# Altium schematic sheet betaV1.0.SchDoc
size A2
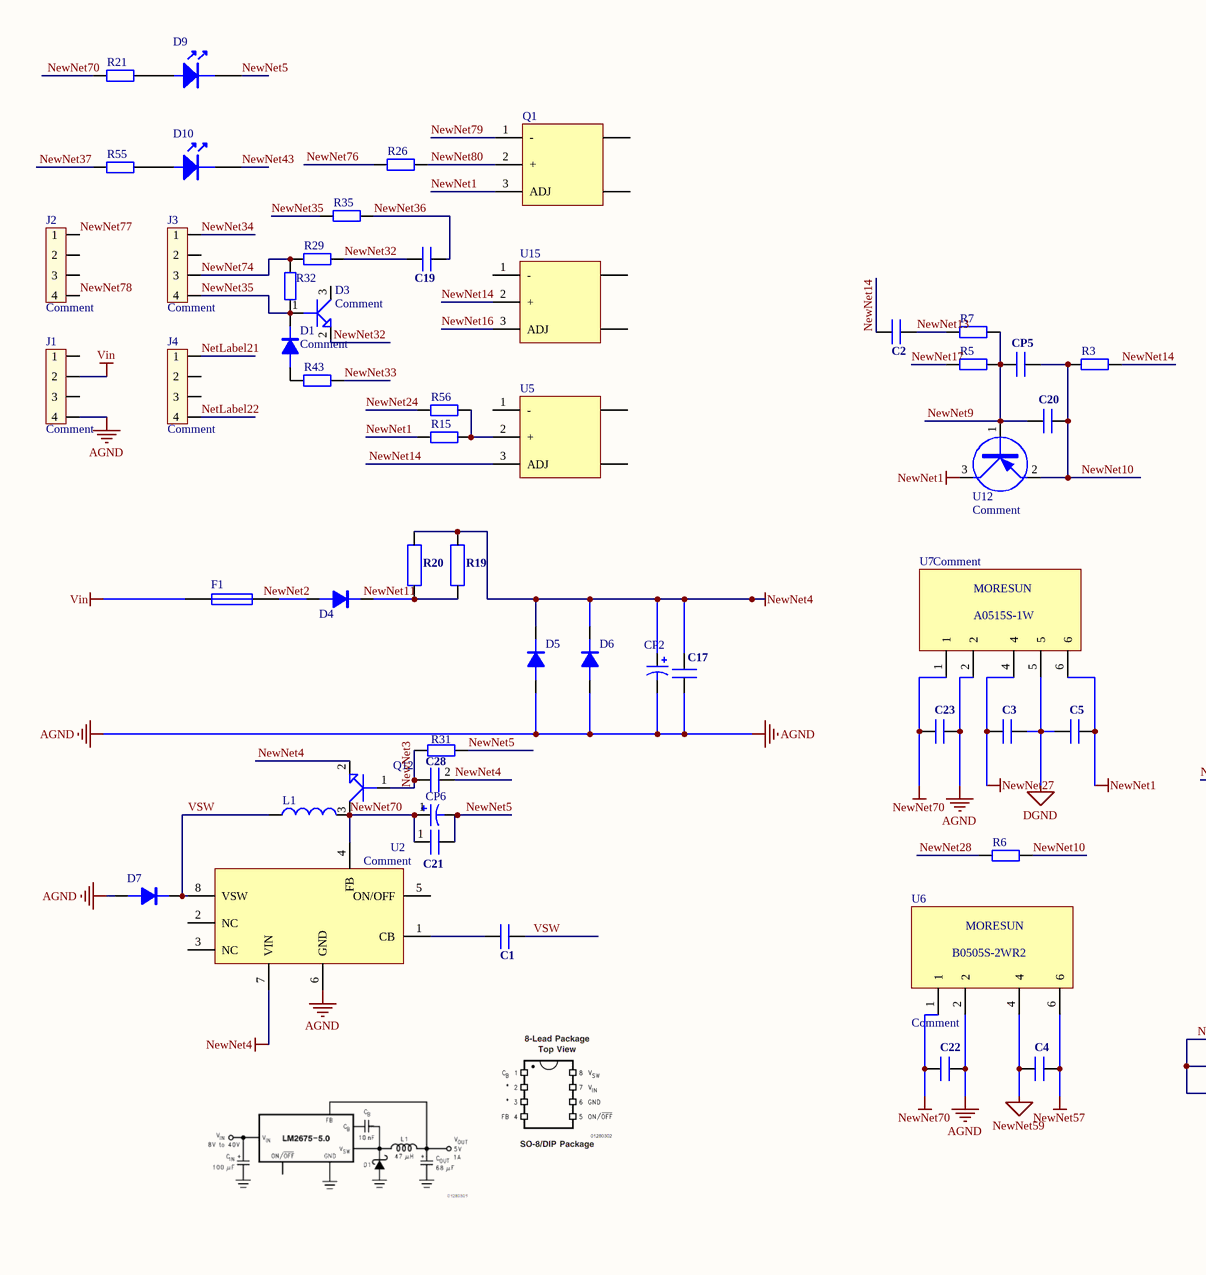
[diagram p0: betaV1.0.SchDoc, left]
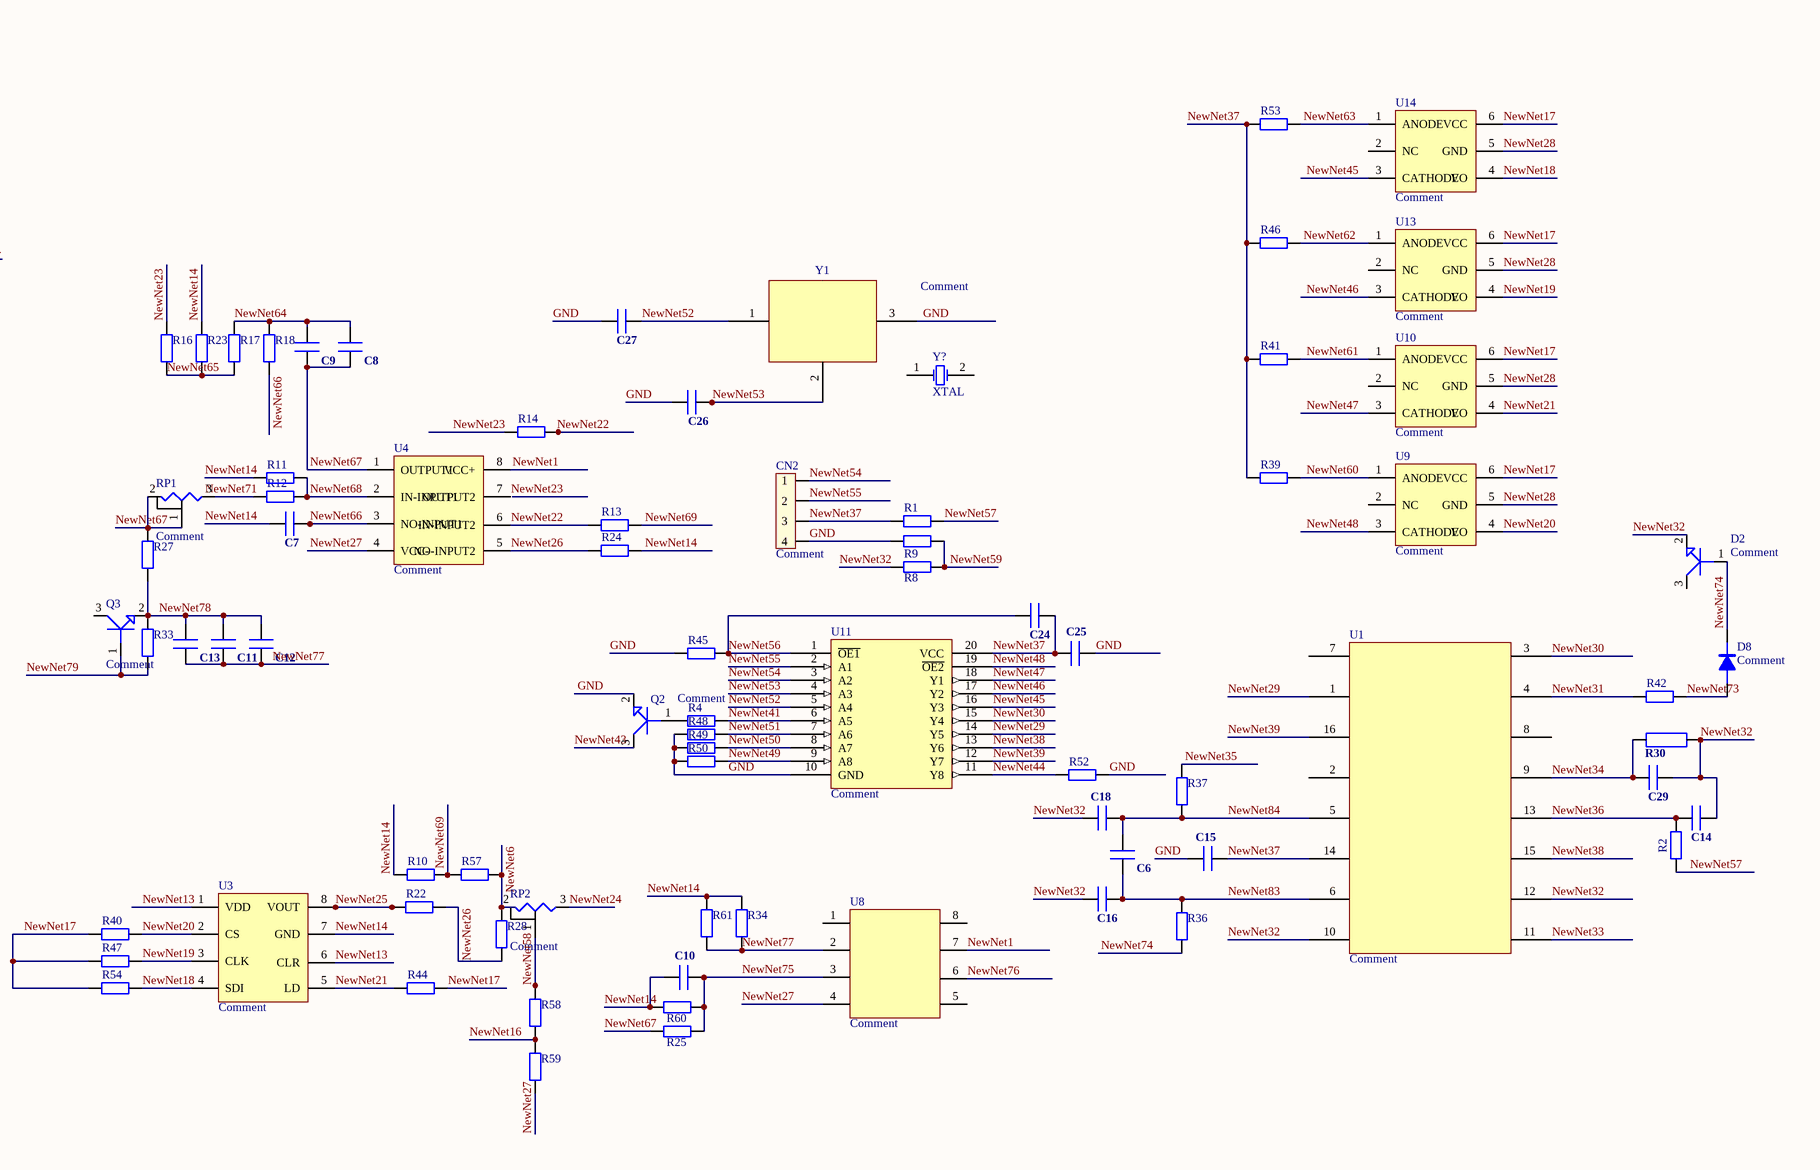
[diagram p1: betaV1.0.SchDoc, right]

## Parts
C1  Comment  [C0805]  (value not drawn)
C2  Comment  [C0805]  (value not drawn)
C3  Comment  [C0805]  (value not drawn)
C4  Comment  [C0805]  (value not drawn)
C5  Comment  [C0805]  (value not drawn)
C6  Comment  [C0805]  (value not drawn)
C7  Comment  [C0805]  (value not drawn)
C8  Comment  [C0805]  (value not drawn)
C9  Comment  [C0805]  (value not drawn)
C10  Comment  [C0805]  (value not drawn)
C11  Comment  [C0805]  (value not drawn)
C12  Comment  [C0805]  (value not drawn)
C13  Comment  [C0805]  (value not drawn)
C14  Comment  [C0805]  (value not drawn)
C15  Comment  [C0805]  (value not drawn)
C16  Comment  [C0805]  (value not drawn)
C17  Comment  [C0805]  (value not drawn)
C18  Comment  [C0805]  (value not drawn)
C19  Comment  [C0805]  (value not drawn)
C20  Comment  [C0805]  (value not drawn)
C21  Comment  [C0805]  (value not drawn)
C22  Comment  [C0805]  (value not drawn)
C23  Comment  [C0805]  (value not drawn)
C24  Comment  [C0805]  (value not drawn)
C25  Comment  [C0805]  (value not drawn)
C26  Comment  [C0805]  (value not drawn)
C27  Comment  [C0805]  (value not drawn)
C28  Comment  [C0805]  (value not drawn)
C29  Comment  [C0805]  (value not drawn)
CN2  Comment  [HDR2.54-LI-4P]
CP2  Comment  [CAP 3.5*8*11.5]  (value not drawn)
CP5  Comment  [CD B(3528)]  (value not drawn)
CP6  Comment  [CAP 3.5*8*11.5]  (value not drawn)
D1  Comment  [SOD-123]
D2  Comment  [SOT-23]
D3  Comment  [SOT-23]
D4  Comment  [SS14]  (value not drawn)
D5  Comment  [SMB]  (value not drawn)
D6  Comment  [SMB]  (value not drawn)
D7  (no value)  [SS14]
D8  Comment  [SOD-123]
D9  (no value)  [LED 3MM-R]
D10  (no value)  [LED 3MM-R]
F1  Comment  [FU 1812]  (value not drawn)
J1  Comment  [电源输入/出]
J2  Comment  [电源输入/出]
J3  Comment  [电源输入/出]
J4  Comment  [电源输入/出]
L1  Comment  [PK0810]  (value not drawn)
Q1  (no value)  [LM336]
Q2  Comment  [SOT-23]
Q3  Comment  [SOT-23]
Q12  (no value)  [SOT-23]
R1  Comment  [R0805]  (value not drawn)
R2  Comment  [R0805]  (value not drawn)
R3  Comment  [R0805]  (value not drawn)
R4  Comment  [R0805]  (value not drawn)
R5  Comment  [R0805]  (value not drawn)
R6  Comment  [R0805]  (value not drawn)
R7  Comment  [R0805]  (value not drawn)
R8  Comment  [R0805]  (value not drawn)
R9  Comment  [R0805]  (value not drawn)
R10  Comment  [R0805]  (value not drawn)
R11  Comment  [R0805]  (value not drawn)
R12  Comment  [R0805]  (value not drawn)
R13  Comment  [R0805]  (value not drawn)
R14  Comment  [R0805]  (value not drawn)
R15  Comment  [R0805]  (value not drawn)
R16  Comment  [R0805]  (value not drawn)
R17  Comment  [R0805]  (value not drawn)
R18  Comment  [R0805]  (value not drawn)
R19  Comment  [金属膜电阻-RS 1/2W-V4]  (value not drawn)
R20  Comment  [金属膜电阻-RS 1/2W-V4]  (value not drawn)
R21  Comment  [R0805]  (value not drawn)
R22  Comment  [R0805]  (value not drawn)
R23  Comment  [R0805]  (value not drawn)
R24  Comment  [R0805]  (value not drawn)
R25  Comment  [R0805]  (value not drawn)
R26  Comment  [R0805]  (value not drawn)
R27  Comment  [R0805]  (value not drawn)
R28  Comment  [R0805]  (value not drawn)
R29  Comment  [R0805]  (value not drawn)
R30  Comment  [金属膜电阻-RS 1/2W-V4]  (value not drawn)
R31  Comment  [R0805]  (value not drawn)
R32  Comment  [R0805]  (value not drawn)
R33  Comment  [R0805]  (value not drawn)
R34  Comment  [RS 1/2W]  (value not drawn)
R35  Comment  [R0805]  (value not drawn)
R36  Comment  [R0805]  (value not drawn)
R37  Comment  [R0805]  (value not drawn)
R39  Comment  [R0805]  (value not drawn)
R40  Comment  [R0805]  (value not drawn)
R41  Comment  [R0805]  (value not drawn)
R42  10k  [R0805]  (value not drawn)
R43  Comment  [R0805]  (value not drawn)
R44  Comment  [R0805]  (value not drawn)
R45  Comment  [R0805]  (value not drawn)
R46  Comment  [R0805]  (value not drawn)
R47  Comment  [R0805]  (value not drawn)
R48  Comment  [R0805]  (value not drawn)
R49  Comment  [R0805]  (value not drawn)
R50  Comment  [R0805]  (value not drawn)
R52  Comment  [R0805]  (value not drawn)
R53  Comment  [R0805]  (value not drawn)
R54  Comment  [R0805]  (value not drawn)
R55  Comment  [R0805]  (value not drawn)
R56  Comment  [R0805]  (value not drawn)
R57  Comment  [R0805]  (value not drawn)
R58  Comment  [R0805]  (value not drawn)
R59  Comment  [R0805]  (value not drawn)
R60  Comment  [R0805]  (value not drawn)
R61  Comment  [R0805]  (value not drawn)
RP1  Comment  [可调电阻]
RP2  Comment  [可调电阻]
U1  Comment  [TSSOP16]
U2  Comment  [SO-8]
U3  Comment  [SO-8]
U4  Comment  [SO-8]
U5  (no value)  [LM336]
U6  Comment  [B0505S-2WR2]
U7  Comment  [B0505S-2WR2]
U8  Comment  [SO-8]
U9  Comment  [PC400]
U10  Comment  [PC400]
U11  Comment  [12C5616AD-SOP20]
U12  Comment  [SOT-89]
U13  Comment  [PC400]
U14  Comment  [PC400]
U15  (no value)  [LM336]
Y1  Comment  [晶振]
Y?  XTAL  [R38]

## Nets
AGND: C17.2 C22.1 C23.1 CP2.2 D5.1(A) D6.1(A) D7.2(K) J1.4 U2.6(GND) U6.2 U7.2
DGND: C3.1 C5.2 U7.5
NewNet1: C5.1 Q1.3(ADJ) R15.1 U4.8(VCC+) U7.6 U8.7(GND) U12.3(C)
NewNet4: C17.1 C28.2 CP2.1 D5.2(K) D6.2(K) Q12.2(E) R19.1 R20.1 U2.7(VIN)
NewNet27: C3.2 R59.2 U4.4(VCC-) U7.4 U8.4(SDI)
NewNet57: C4.1 R1.1 R2.2 U6.6
NewNet59: C4.2 R8.1 R9.2 U6.4
NewNet70: C21.1 C22.2 C23.2 CP6.1 L1.2 Q12.3(C) R21.2 U2.4(FB) U6.1 U7.1
Vin: F1.1 J1.2
GND: C15.1 C25.2 C26.2 C27.2 CN2.4 Q2.2(E) R9.1 R45.1 R48.2 R49.2 R50.2 R52.1 U11.10(GND) Y1.3(OUT)
NetLabel21: J4.1
NetLabel22: J4.4
NewNet3: C28.1 Q12.1(B) R31.1
NewNet5: C21.2 CP6.2 D9.2 R31.2
NewNet6: R28.1 R57.1 RP2.2
NewNet9: C20.1 CP5.1 R5.2 R7.2 U12.1(B)
NewNet10: C20.2 CP5.2 R3.2 R6.2 U12.2(E)
NewNet13: C2.1 R7.1 U3.1(VDD) U3.6(CLR)
NewNet14: C2.2 C7.1 C10.1 R3.1 R10.1 R11.1 R23.1 R24.2 R34.1 R60.1 R61.1 U3.7(GND) U5.3(ADJ) U15.2(+)
NewNet16: R58.1 R59.1 U15.3(ADJ)
NewNet17: R5.1 R40.2 R44.2 R47.2 R54.2 U9.6(VCC) U10.6(VCC) U13.6(VCC) U14.6(VCC)
NewNet18: R54.1 U3.4(SDI) U14.4(VO)
NewNet19: R47.1 U3.3(CLK) U13.4(VO)
NewNet20: R40.1 U3.2(CS) U9.4(VO)
NewNet21: R44.1 U3.5(LD) U10.4(VO)
NewNet22: R13.1 R14.1 U4.6(IN-INPUT2)
NewNet23: R14.2 R16.1 U4.7(OUTPUT2)
NewNet24: R56.2 RP2.3
NewNet25: R22.2 U3.8(VOUT)
NewNet26: R22.1 R24.1 R28.2 U4.5(NO-INPUT2)
NewNet28: R6.1 U9.5(GND) U10.5(GND) U13.5(GND) U14.5(GND)
NewNet29: U1.1(VIN) U11.14(Y5)
NewNet30: U1.3(CS1) U11.15(Y4)
NewNet31: R42.1 U1.4(CS2)
NewNet32: C14.2 C16.2 C18.1 C19.2 C29.2 D2.2(E) D3.2(E) R8.2 R29.1 R30.2 U1.10(PGND) U1.12(SS)
NewNet33: R43.1 U1.11(ANGD)
NewNet34: C29.1 J3.1 R30.1 U1.9(OUTB)
NewNet35: D1.2(K) D3.1(B) J3.4 R32.2 R35.1 R37.2
NewNet36: C14.1 C19.1 R2.1 R35.2 U1.13(COMP)
NewNet37: C15.2 C24.2 C25.1 CN2.3 R1.2 R39.1 R41.1 R46.1 R53.1 R55.1 U1.14(RT) U11.20(VCC)
NewNet38: U1.15(SYNC) U11.13(Y6)
NewNet39: U1.16(UVLO) U11.12(Y7)
NewNet41: R4.1 U11.6(A5)
NewNet43: D10.2 Q2.3(C)
NewNet44: R52.2 U11.11(Y8)
NewNet45: U11.16(Y3) U14.3(CATHODE)
NewNet46: U11.17(Y2) U13.3(CATHODE)
NewNet47: U10.3(CATHODE) U11.18(Y1)
NewNet48: U9.3(CATHODE) U11.19(~{OE2})
NewNet49: R50.1 U11.9(A8)
NewNet50: R49.1 U11.8(A7)
NewNet51: R48.1 U11.7(A6)
NewNet52: C27.1 U11.5(A4) Y1.1(CONTRL)
NewNet53: C26.1 U11.4(A3) Y1.2(GND)
NewNet54: CN2.1 U11.3(A2)
NewNet55: CN2.2 U11.2(A1)
NewNet56: C24.1 R45.2 U11.1(~{OE1})
NewNet58: R58.2 RP2.1
NewNet60: R39.2 U9.1(ANODE)
NewNet61: R41.2 U10.1(ANODE)
NewNet62: R46.2 U13.1(ANODE)
NewNet63: R53.2 U14.1(ANODE)
NewNet64: C8.1 C9.1 R17.1 R18.1
NewNet65: R16.2 R17.2 R23.2
NewNet66: C7.2 R18.2 U4.3(NO-INPUT1)
NewNet67: C8.2 C9.2 R25.2 R27.1 RP1.1 RP1.2 U4.1(OUTPUT1)
NewNet68: R11.2 R12.2 U4.2(IN-INPUT1)
NewNet69: R10.2 R13.2 R57.2
NewNet73: D8.1(A) R42.2
NewNet74: D2.1(B) D8.2(K) J3.3 R29.2 R32.1 R36.2
NewNet75: C10.2 R25.1 R60.2 U8.3(CLK)
NewNet76: R26.2 U8.6(CLR)
NewNet77: C11.2 C12.2 C13.2 J2.1 R34.2 R61.2 U8.2(CS)
NewNet78: C11.1 C12.1 C13.1 J2.4 Q3.2(E) R27.2 R33.1
NewNet79: Q1.1(-) Q3.1(B) R33.2
NewNet80: Q1.2(+) R26.1
NewNet83: C6.2 C16.1 R36.1 U1.6(REF)
NewNet84: C6.1 C18.2 R37.1 U1.5(TIME)
VSW: C1.1 D7.1(A) L1.1 U2.8(VSW)
NetC1_2: C1.2 U2.1(CB)
NetD1_1: D1.1(A) R43.2
NetD4_1: D4.1(A) F1.2
NetD4_2: D4.2(K) R19.2 R20.2
NetD9_1: D9.1 R21.1
NetD10_1: D10.1 R55.2
NetQ2_1: Q2.1(B) R4.2
NetR12_1: R12.1 RP1.3
NetR15_2: R15.2 R56.1 U5.2(+)

Not connected (* = marked no-connect by the designer): D2 3(C); D3 3(C); J1 1 3; J2 2 3; J3 2; J4 2 3; Q1 4 5; Q3 3(C); U1 2(RAMP) 7(VCC) 8(OUTA); U2 2(NC) 3(NC) 5(ON/OFF); U5 1(-) 4 5; U8 1(VDD) 5(LD) 8(VOUT); U9 2(NC); U10 2(NC); U13 2(NC); U14 2(NC); U15 1(-) 4 5; Y1 4(VDD); Y? 1(OSC1) 2(OSC2)

## Notes on the sheet
- Labels drawn without touching a wire or pin: NewNet2, NewNet11, NewNet71
- (in symbol A0515S-1W) MORESUN
- (in symbol B0505S2W) MORESUN; B0505S-2WR2

## Library data of the parts
C1 = 04-02-01: VALUE: 50V/103
C2-C16 C18-C20 C22-C27 C29 CP5 = 04-02-01: VALUE: 25V/105
C17 C21 C28 = 04-02-01: VALUE: 50V/104
CN2 J1-J4 = CON4
CP2 CP6 = Cap Pol3: Value: 50V100UF
D1 D5-D8 = DIODE
D2 D3 Q2 Q3 Q12 = NPN-SOT23
D4 = DIODE: VALUE: 1A/40V
D9 D10 = LED
F1 = Fuse 1: VALUE: 1A/50V
L1 = Inductor: Value: 47uH
Q1 U5 U15 = SN74LVC
R1-R18 R21-R29 R31-R37 R39-R50 R52-R61 = Res: Resistor; Published: 8-Jun-2000; LatestRevisionDate: 17-Jul-2002; LatestRevisionNote: Re-released for DXP Platform.; PackageReference: AXIAL-0.4; Publisher: Altium Limited
R19 R20 R30 = R: VALUE: 1W/10R
RP1 RP2 = RES_1
U1 = LM5025
U2 = LM2756
U3 U4 U8 = SI8420BB
U6 = B0505S2W
U7 = A0515S-1W
U9 U10 U13 U14 = MAX5078
U11 = SN74LV5: 八路三态门
U12 = PNP-SOT89
Y1 = CVHD‐950‐122.880
Y? = XTAL: Crystal Oscillator; Published: 8-Jun-2000; LatestRevisionDate: 17-Jul-2002; LatestRevisionNote: Re-released for DXP Platform.; PackageReference: R38; Publisher: Altium Limited; PackageDescription: Crystal, Thru-Hole; 2 Leads; Body 3.1 x 8.2 mm (Dia.xH)